# Altium schematic sheet FourInOneSensorBoardCO2-V1.0.SchDoc
size A3
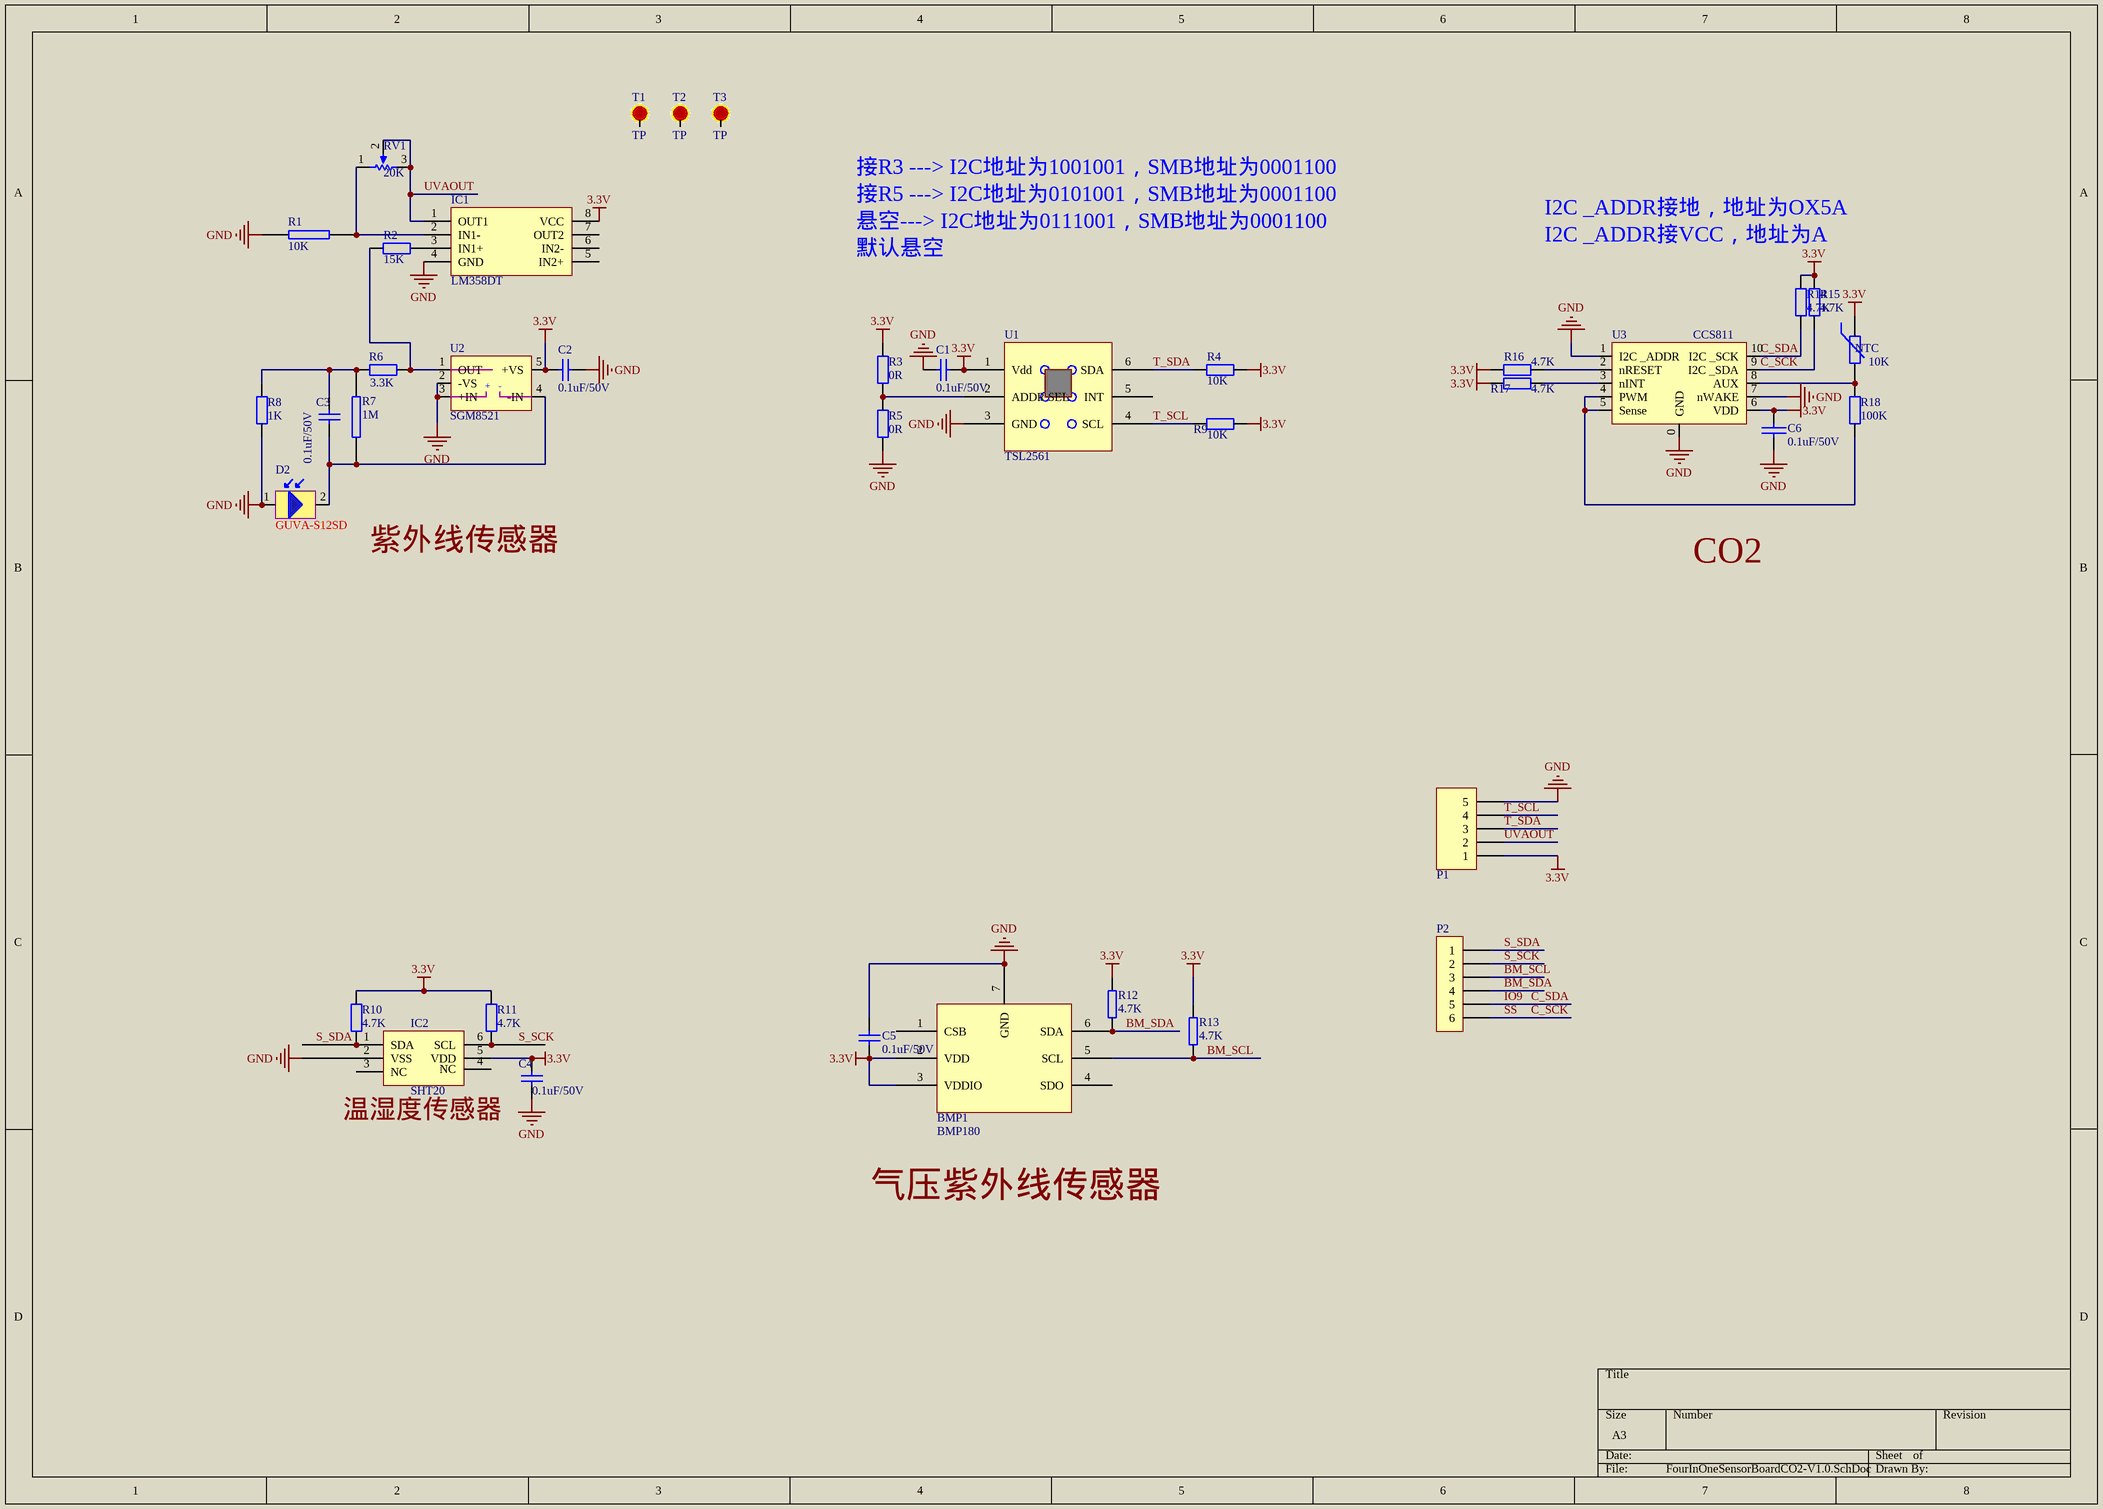
[diagram p0: FourInOneSensorBoardCO2-V1.0.SchDoc]

## Parts
BMP1  BMP180  [BMP180]
C1  0.1uF/50V  [C-0603]
C2  0.1uF/50V  [C-0603]
C3  0.1uF/50V  [C-0603]
C4  0.1uF/50V  [C-0603]
C5  0.1uF/50V  [C-0603]
C6  0.1uF/50V  [C-0603]
D2  GUVA-S12SD  [GUVA-S12SD]
IC1  LM358DT  [SOIC8_39MM]
IC2  SHT20  [SHT20]
NTC  10K  [NTC]
P1  JXT-5-l  [JXT-5-l]  (value not drawn)
P2  JXT-6-I  [JXT-6-l]  (value not drawn)
R1  10K  [R-0603]
R2  15K  [R-0603]
R3  0R  [R-0603]
R4  10K  [R-0603]
R5  0R  [R-0603]
R6  3.3K  [R-0603]
R7  1M  [R-0603]
R8  1K  [R-0603]
R9  10K  [R-0603]
R10  4.7K  [R-0603]
R11  4.7K  [R-0603]
R12  4.7K  [R-0603]
R13  4.7K  [R-0603]
R14  4.7K  [R-0603]
R15  4.7K  [R-0603]
R16  4.7K  [R-0603]
R17  4.7K  [R-0603]
R18  100K  [R-0603]
RV1  20K  [VR3362P]
T1  TP  [安装孔-M6]
T2  TP  [安装孔-M6]
T3  TP  [安装孔-M6]
U1  TSL2561  [TSL2561_FN]
U2  SGM8521  [SOT-23-5]
U3  CCS811  [CCS811]

## Nets
3.3V: BMP1.2(VDD) BMP1.3(VDDIO) C1.1 C2.2 C4.1 C5.2 C6.1 IC1.8(VCC) IC2.5(VDD) NTC.1 P1.1 R3.1 R4.1 R9.2 R10.2 R11.2 R12.2 R13.2 R14.1 R15.1 R16.2 R17.2 U1.1(Vdd) U2.5(+VS) U3.6(VDD)
GND: BMP1.7(GND) C1.2 C2.1 C4.2 C5.1 C6.2 D2.1 IC1.4(GND) IC2.2(VSS) P1.5 R1.1 R5.1 R8.1 U1.3(GND) U2.2(-VS) U2.3(+IN) U3.0(GND) U3.1(I2C__ADDR) U3.7(nWAKE)
BM_SCL: BMP1.5(SCL) P2.3 R13.1
BM_SDA: BMP1.6(SDA) P2.4 R12.1
C_SCK: P2.6 R15.2 U3.9(I2C__SDA)  [also labelled SS]
C_SDA: P2.5 R14.2 U3.10(I2C__SCK)  [also labelled IO9]
S_SCK: IC2.6(SCL) P2.2 R11.1
S_SDA: IC2.1(SDA) P2.1 R10.1
T_SCL: P1.4 R9.1 U1.4(SCL)
T_SDA: P1.3 R4.2 U1.6(SDA)
UVAOUT: IC1.1(OUT1) P1.2 RV1.2(TAP) RV1.3(TOP)
NetC3_1: C3.1 R6.2 R7.1 R8.2
NetC3_2: C3.2 D2.2 R7.2 U2.4(-IN)
NetIC1_2: IC1.2(IN1-) R1.2 RV1.1(BOT)
NetIC1_3: IC1.3(IN1+) R2.1
NetNTC_2: NTC.2 R18.1 U3.8(AUX)
NetR2_2: R2.2 R6.1 U2.1(OUT)
NetR3_2: R3.2 R5.2 U1.2(ADDR_SEL)
NetR16_1: R16.1 U3.2(nRESET)
NetR17_1: R17.1 U3.3(nINT)
NetR18_2: R18.2 U3.4(PWM) U3.5(Sense)

Not connected (* = marked no-connect by the designer): BMP1 1(CSB) 4(SDO); IC1 5(IN2+) 6(IN2-) 7(OUT2); IC2 3(NC) 4(NC); T1 1(T); T2 1(T); T3 1(T); U1 5(INT)

## Notes on the sheet
- 接R3 ---> I2C地址为1001001，SMB地址为0001100
- 悬空---> I2C地址为0111001，SMB地址为0001100
- 接R5 ---> I2C地址为0101001，SMB地址为0001100
- I2C _ADDR接地，地址为OX5A
- I2C _ADDR接VCC，地址为A
- 默认悬空
- 紫外线传感器
- CO2
- (near IC2) 温湿度传感器
- 气压紫外线传感器
- (in symbol SGM8521) +; -

## Library data of the parts
BMP1 = BMP180: 气压传感器
C1-C5 = Cap: 贴片电容; Value: 0.1uF; Published: 8-Jun-2000; LatestRevisionDate: 17-Jul-2002; LatestRevisionNote: Re-released for DXP Platform.; PackageReference: RAD-0.3; Publisher: Altium Limited; PackageDescription: Radial Cap, Thru-Hole; 2 Leads; 0.3 in Pin Spacing
C6 = CAP: 贴片电容
D2 = GUVA-S12SD: 紫外线传感器; Code - JEDEC: DO-214-AA; Published: 8-Jun-2000; Revision: July-2002: Re-released for DXP Platform.; Publisher: Altium Limited
IC1 = LM358DT: 通用运放
IC2 = SHT20: 温湿度传感器
NTC = RES-NTC/PTC: 热敏电阻; Value: Θ; Published: 24-Mar-1999; Revision: July-2002: Re-released for DXP Platform.; Publisher: Altium Limited
P1 = Header 5: 1.27立式贴片针座; LatestRevisionDate: 17-Jul-2002; LatestRevisionNote: Re-released for DXP Platform.; Publisher: Altium Limited
P2 = Header 6: 1.27立式贴片针座; LatestRevisionDate: 17-Jul-2002; LatestRevisionNote: Re-released for DXP Platform.; Publisher: Altium Limited
R1 R3 R5 R6 R10 R11 R14-R17 = R: 贴片电阻
  R3 R5: Published: 8-Jun-2000; LatestRevisionDate: 17-Jul-2002; LatestRevisionNote: Re-released for DXP Platform.; PackageReference: AXIAL-0.4; Publisher: Altium Limited; PackageDescription: Axial Device, Thru-Hole; 2 Leads; 0.4 in Pin Spacing; Value: 0R
  R6: Published: 8-Jun-2000; LatestRevisionDate: 17-Jul-2002; LatestRevisionNote: Re-released for DXP Platform.; PackageReference: AXIAL-0.4; Publisher: Altium Limited; Value: 3.3K
  R10 R11 R14-R17: Published: 8-Jun-2000; LatestRevisionDate: 17-Jul-2002; LatestRevisionNote: Re-released for DXP Platform.; PackageReference: AXIAL-0.4; Publisher: Altium Limited; Value: 4.7K
R2 R4 R8 R9 = Res2: 贴片电阻; Published: 8-Jun-2000; LatestRevisionDate: 17-Jul-2002; LatestRevisionNote: Re-released for DXP Platform.; PackageReference: AXIAL-0.4; Publisher: Altium Limited; PackageDescription: Axial Device, Thru-Hole; 2 Leads; 0.4 in Pin Spacing
  R2: Value: 15K
  R4 R9: Value: 10K
  R8: Value: 1K
R7 R12 R13 = RES2: 贴片电阻
  R12 R13: Value: 4.7K
R18 = R: 贴片电阻; Value: 4.7K; Published: 8-Jun-2000; LatestRevisionDate: 17-Jul-2002; LatestRevisionNote: Re-released for DXP Platform.; PackageReference: AXIAL-0.4; Publisher: Altium Limited
RV1 = RV_1: 滑动变阻
U1 = TSL2561: 光照度传感器
U2 = SGM8521: 低功耗运放
U3 = CCS811: CO2传感器